# EAGLE design iss2 yuvmod (EAGLE 7.6.0)
PROJECT_NAME: ZX Spectrum Issue 2 - YUV auto bias mod
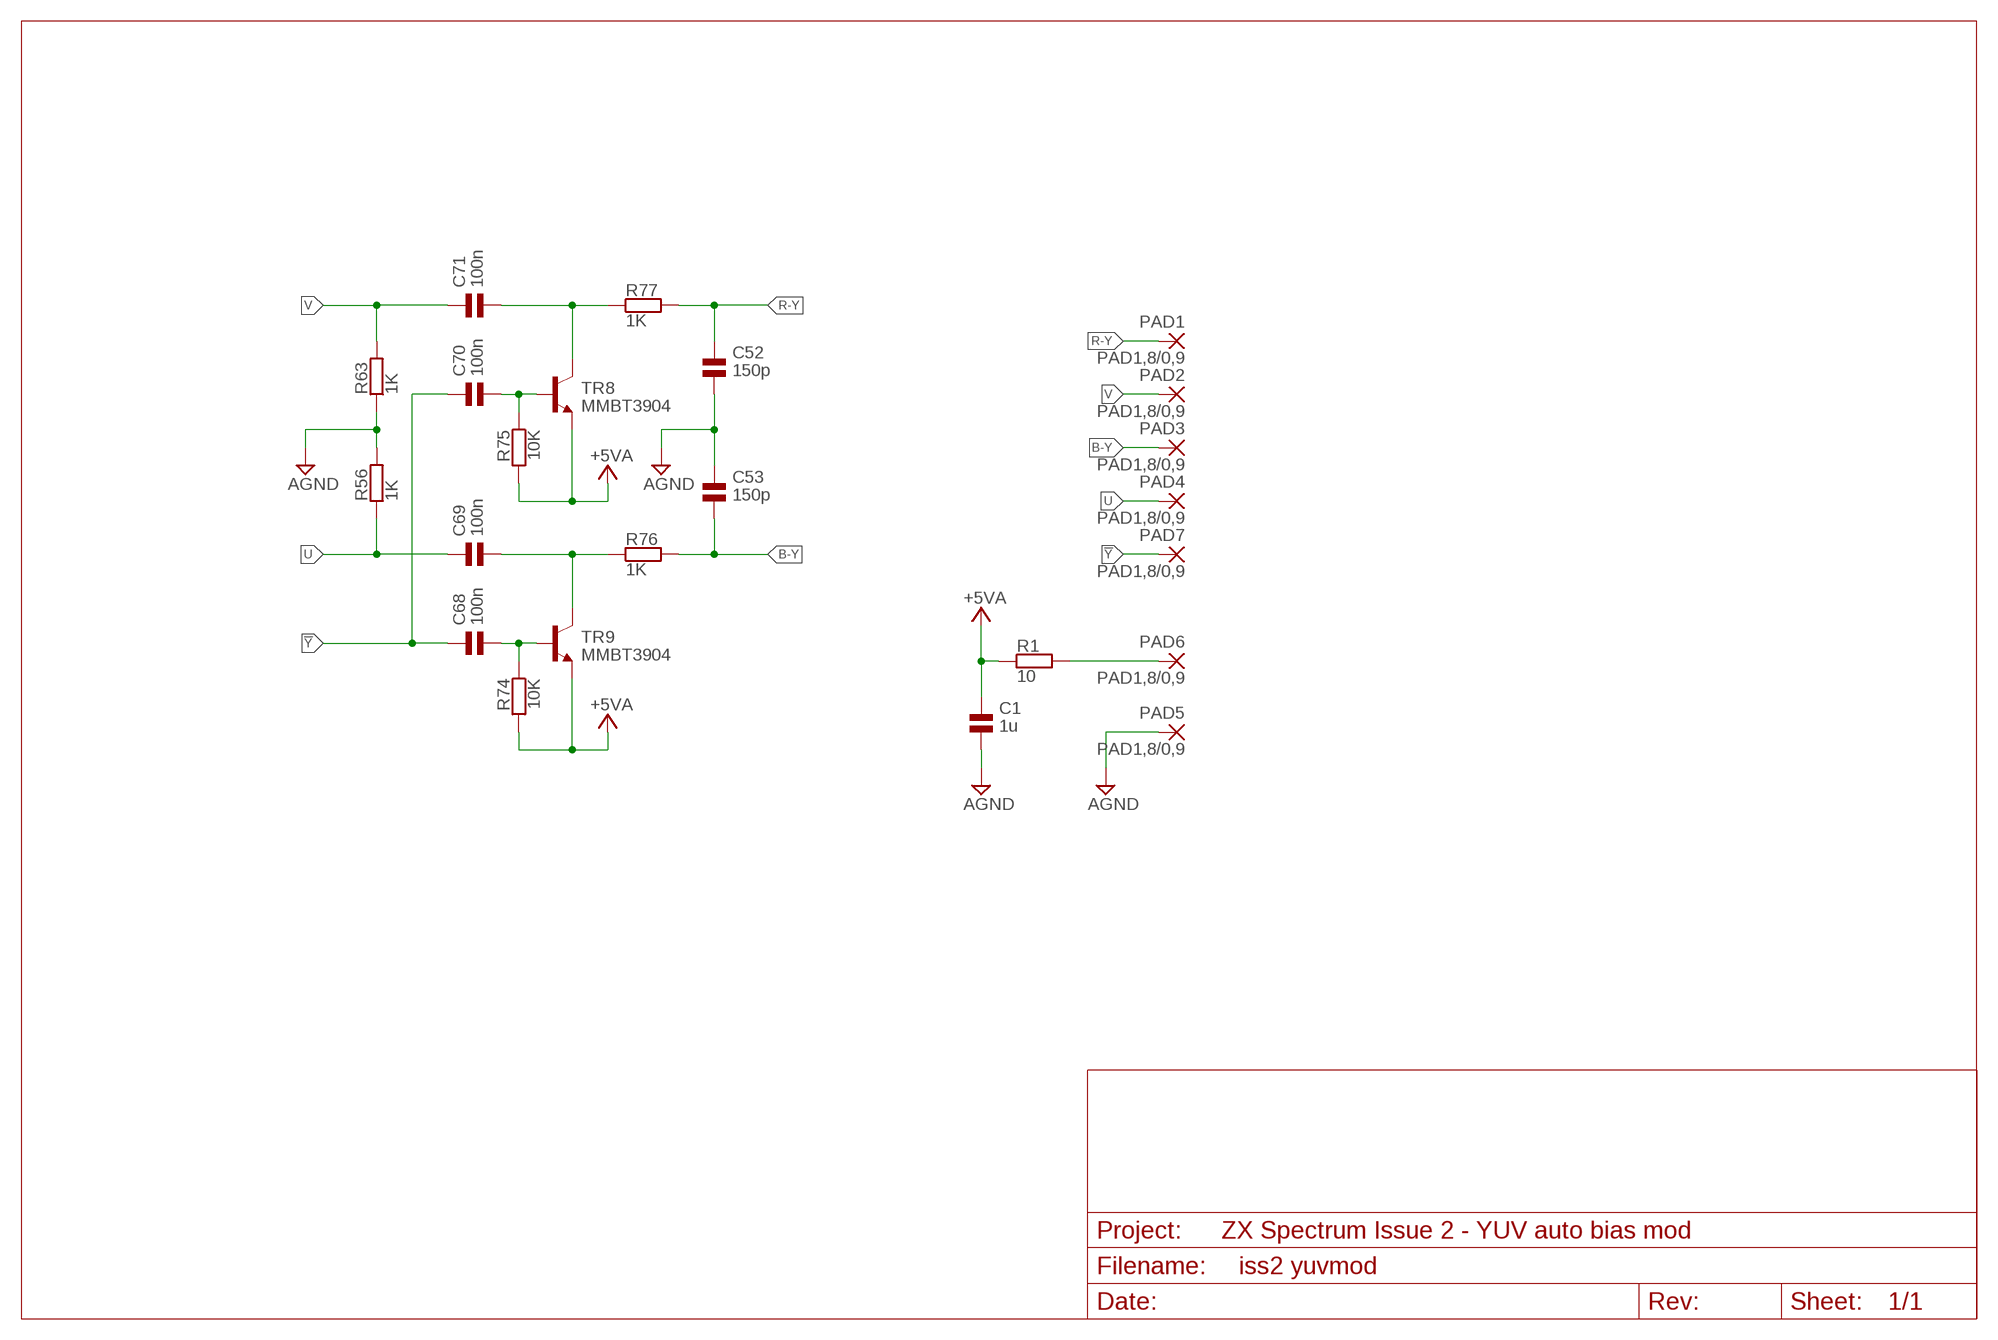
[diagram p0: schematic, sheet 1]

## Parts
C1  1u  CAP_NPOL-0603  [0603]
C52  150p  CAP_NPOL-0603  [0603]
C53  150p  CAP_NPOL-0603  [0603]
C68  100n  CAP_NPOL-0603  [0603]
C69  100n  CAP_NPOL-0603  [0603]
C70  100n  CAP_NPOL-0603  [0603]
C71  100n  CAP_NPOL-0603  [0603]
PAD1  PAD1,8/0,9  [1,8/0,9]
PAD2  PAD1,8/0,9  [1,8/0,9]
PAD3  PAD1,8/0,9  [1,8/0,9]
PAD4  PAD1,8/0,9  [1,8/0,9]
PAD5  PAD1,8/0,9  [1,8/0,9]
PAD6  PAD1,8/0,9  [1,8/0,9]
PAD7  PAD1,8/0,9  [1,8/0,9]
R1  10  RES-SMD_0603  [0603]
R56  1K  RES-SMD_0603  [0603]
R63  1K  RES-SMD_0603  [0603]
R74  10K  RES-SMD_0603  [0603]
R75  10K  RES-SMD_0603  [0603]
R76  1K  RES-SMD_0603  [0603]
R77  1K  RES-SMD_0603  [0603]
TR8  MMBT3904  -NPN_SOT23  [SOT23]
TR9  MMBT3904  -NPN_SOT23  [SOT23]

## Nets
!Y: C68.1 C70.1 PAD7.1(P)
+5VA: C1.1 R1.1 R74.2 R75.2 TR8.2(E) TR9.2(E)
AGND: C1.2 C52.2 C53.1 PAD5.1(P) R56.2 R63.1
B-Y: C53.2 PAD3.1(P) R76.2
N$1: PAD6.1(P) R1.2
N$3: C68.2 R74.1 TR9.1(B)
N$4: C70.2 R75.1 TR8.1(B)
N$5: C71.2 R77.1 TR8.3(C)
N$6: C69.2 R76.1 TR9.3(C)
R-Y: C52.1 PAD1.1(P) R77.2
U: C69.1 PAD4.1(P) R56.1
V: C71.1 PAD2.1(P) R63.2

## Library data of the parts
C1 = jc-passive:CAP_NPOL; LCSC_PART: C15849
C52 C53 = jc-passive:CAP_NPOL; LCSC_PART: C1594
C68-C71 = jc-passive:CAP_NPOL; LCSC_PART: C14663
PAD1-PAD7 = jc-connectors:PAD: Wire PAD connect wire on PCB
R1 = jc-passive:RES; LCSC_PART: C22859
R56 R63 R76 R77 = jc-passive:RES; LCSC_PART: C21190
R74 R75 = jc-passive:RES; LCSC_PART: C25804
TR8 TR9 = jc-discretesemi:*-NPN_?; LCSC_PART: C20526

## Board
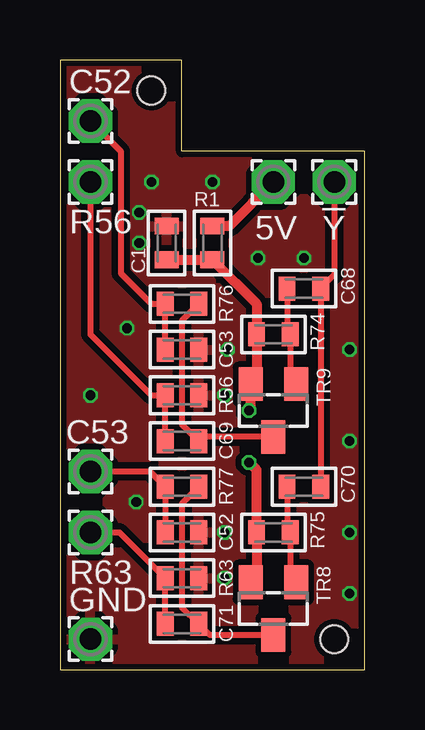
[diagram p1: board, top side]
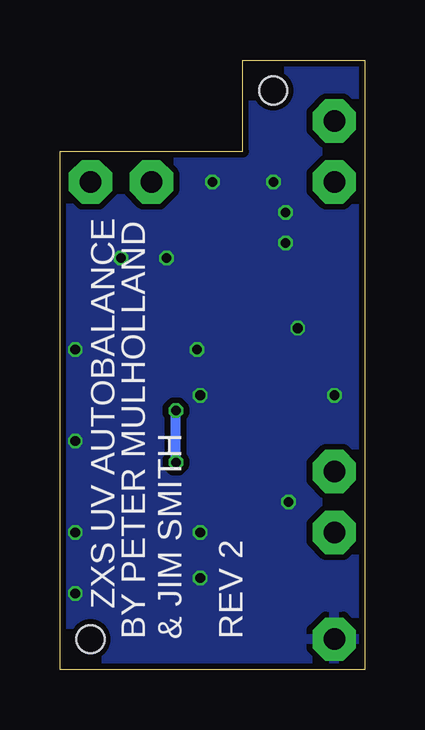
[diagram p2: board, bottom side, seen from below]

Size 12.7 x 25.4 mm. Coordinates in mm from the lower left corner, seen from the top.
Outline: 0,0 12.7,0 12.7,21.59 5.08,21.59 5.08,25.4 0,25.4 0,0
Copper layers (1*16): Top 0.035mm / dielectric 0.2mm / Bottom 0.035mm
Design rules "jlcpcb-2layers": minimum track width 3.5mil, minimum drill 0.2mm, track to track 5mil, track to pad 5mil, pad to pad 5mil, via to via 5mil, smd to smd 0mil, copper to edge 0.1mm, drill to drill 5mil, minimum pad ring 4mil, minimum via ring 4mil, stop-mask expansion 3mil, vias tented up to drill 100mil, thermal gap 10mil
Holes 1.15 mm at 11.43,1.27 3.81,24.13

### Footprints (pad centres in the part's own frame; a part is rotated, then mirrored left to right if it is on the bottom)
0603 = smd 0.7 x 1: 1 -0.7,0; 2 0.7,0
1,8/0,9 = drill 0.9 pad 1.8 octagon: 1 0,0
SOT23 = smd 1 x 1.4: 1 -0.95,-1.1; 2 0.95,-1.1; 3 0,1.1

### Placement (x,y rotation side)
C1  4.45,17.78 90 top
C52  5.08,5.71 0 top
C53  5.08,13.34 180 top
C68  10.16,15.88 180 top
C69  5.08,9.53 0 top
C70  10.16,7.62 180 top
C71  5.08,1.91 0 top
PAD1  1.27,8.26 0 top
PAD2  1.27,5.71 0 top
PAD3  1.27,22.86 0 top
PAD4  1.27,20.32 0 top
PAD5  1.27,1.27 0 top
PAD6  8.89,20.32 0 top
PAD7  11.43,20.32 270 top
R1  6.35,17.78 90 top
R56  5.08,11.43 0 top
R63  5.08,3.81 180 top
R74  8.89,13.97 180 top
R75  8.89,5.71 180 top
R76  5.08,15.24 180 top
R77  5.08,7.62 180 top
TR8  8.89,2.54 180 top
TR9  8.89,10.79 180 top

### Tracks (layer width: path | path; a pad name or v marks a point on that pad's centre or on a via)
!Y
  Top 0.254: PAD7.1 11.43,16.45 C68.1 C70.1
+5VA  (via drill 0.4)
  Top 0.406: C1.1 R1.1 8.19,15.24 R74.2 8.19,11.89 TR9.2 7.94,10.86 v7.87,10.79 | TR8.2 8.19,3.64 R75.2 8.19,8.32 v7.87,8.64
  Bottom 0.406: v7.87,8.64 v7.87,10.79
AGND  (via drill 0.4)
  other vias: 6.99,13.34 6.86,11.43 6.86,5.71 6.86,3.81 2.79,14.22 1.27,11.43 3.17,6.99 6.35,20.32 12.06,3.17 12.06,5.71 12.06,9.53 12.06,13.34 8.26,17.14 10.16,17.14 3.3,17.78 3.3,19.05 3.81,20.32
  pour Top (isolate 0.254): 0,25.4 12.7,25.4 12.7,0 0,0
  pour Bottom (isolate 0.254): 0,25.4 12.7,25.4 12.7,0 0,0
B-Y
  Top 0.254: C53.2 R76.2 3.81,15.24 2.54,16.51 2.54,21.59 PAD3.1
N$1
  Top 0.406: PAD6.1 7.05,18.48 R1.2
N$3
  Top 0.254: TR9.1 9.59,11.89 R74.1 9.46,13.97 C68.2
N$4
  Top 0.254: C70.2 9.46,5.71 R75.1 9.59,3.64 TR8.1
N$5
  Top 0.254: R77.1 5.08,6.92 5.08,2.6 C71.2 6.25,1.44 TR8.3
N$6
  Top 0.254: R76.1 5.08,14.54 5.08,10.22 C69.2 5.95,9.7 TR9.3
R-Y
  Top 0.254: C52.1 R77.2 3.75,8.26 PAD1.1
U
  Top 0.254: C69.1 R56.1 3.81,11.43 1.27,13.97 PAD4.1
V
  Top 0.254: C71.1 R63.2 2.48,5.71 PAD2.1

### Text on the board
tPlace: C52 | R56 | 5V | !Y | C53 | R63 | GND
bPlace: ZXS UV AUTOBALANCE | REV 2 | BY PETER MULHOLLAND / & JIM SMITH